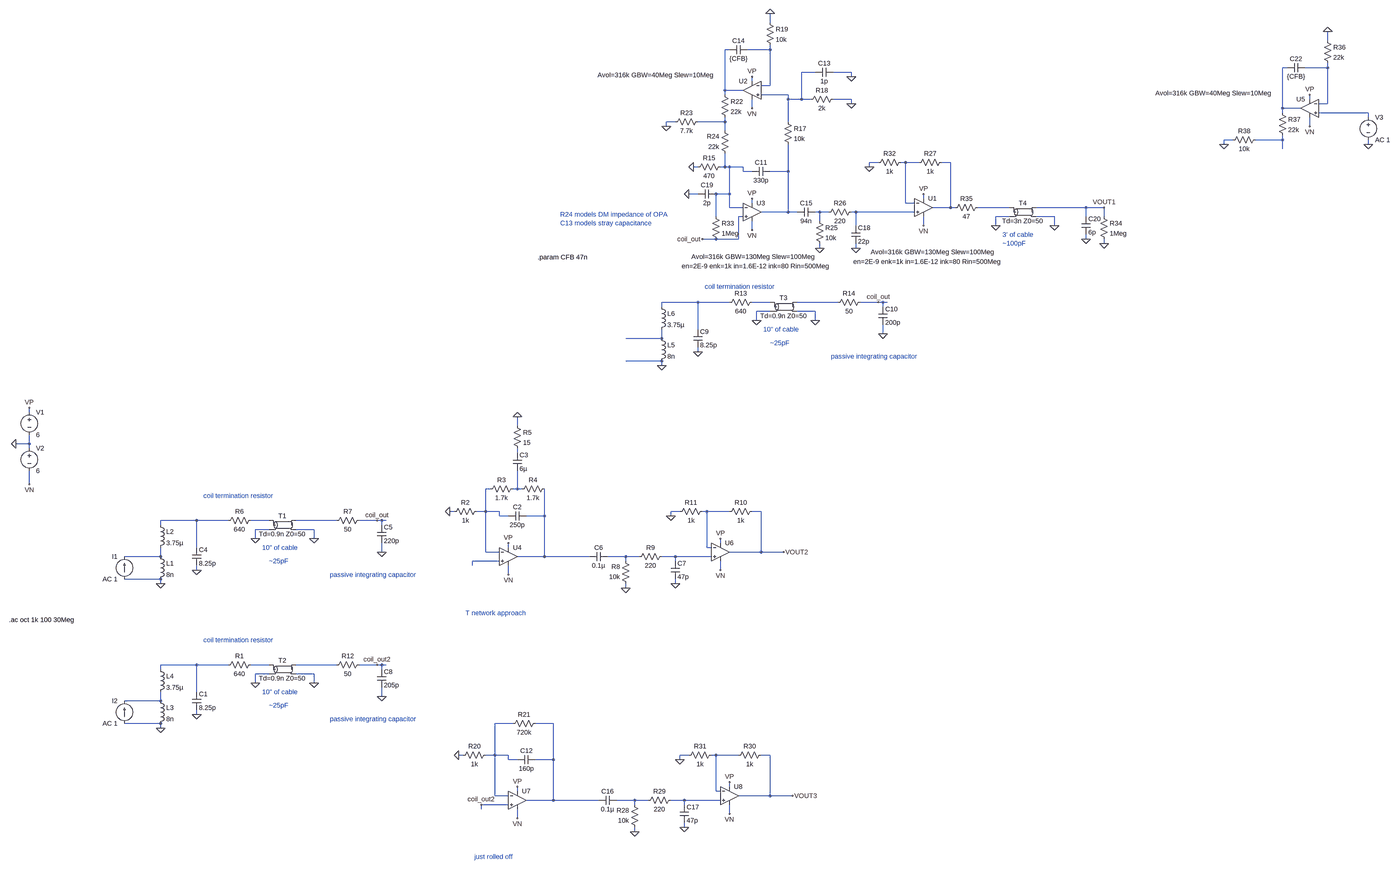
[diagram p0: schematic amp_sim.asc, whole sheet]
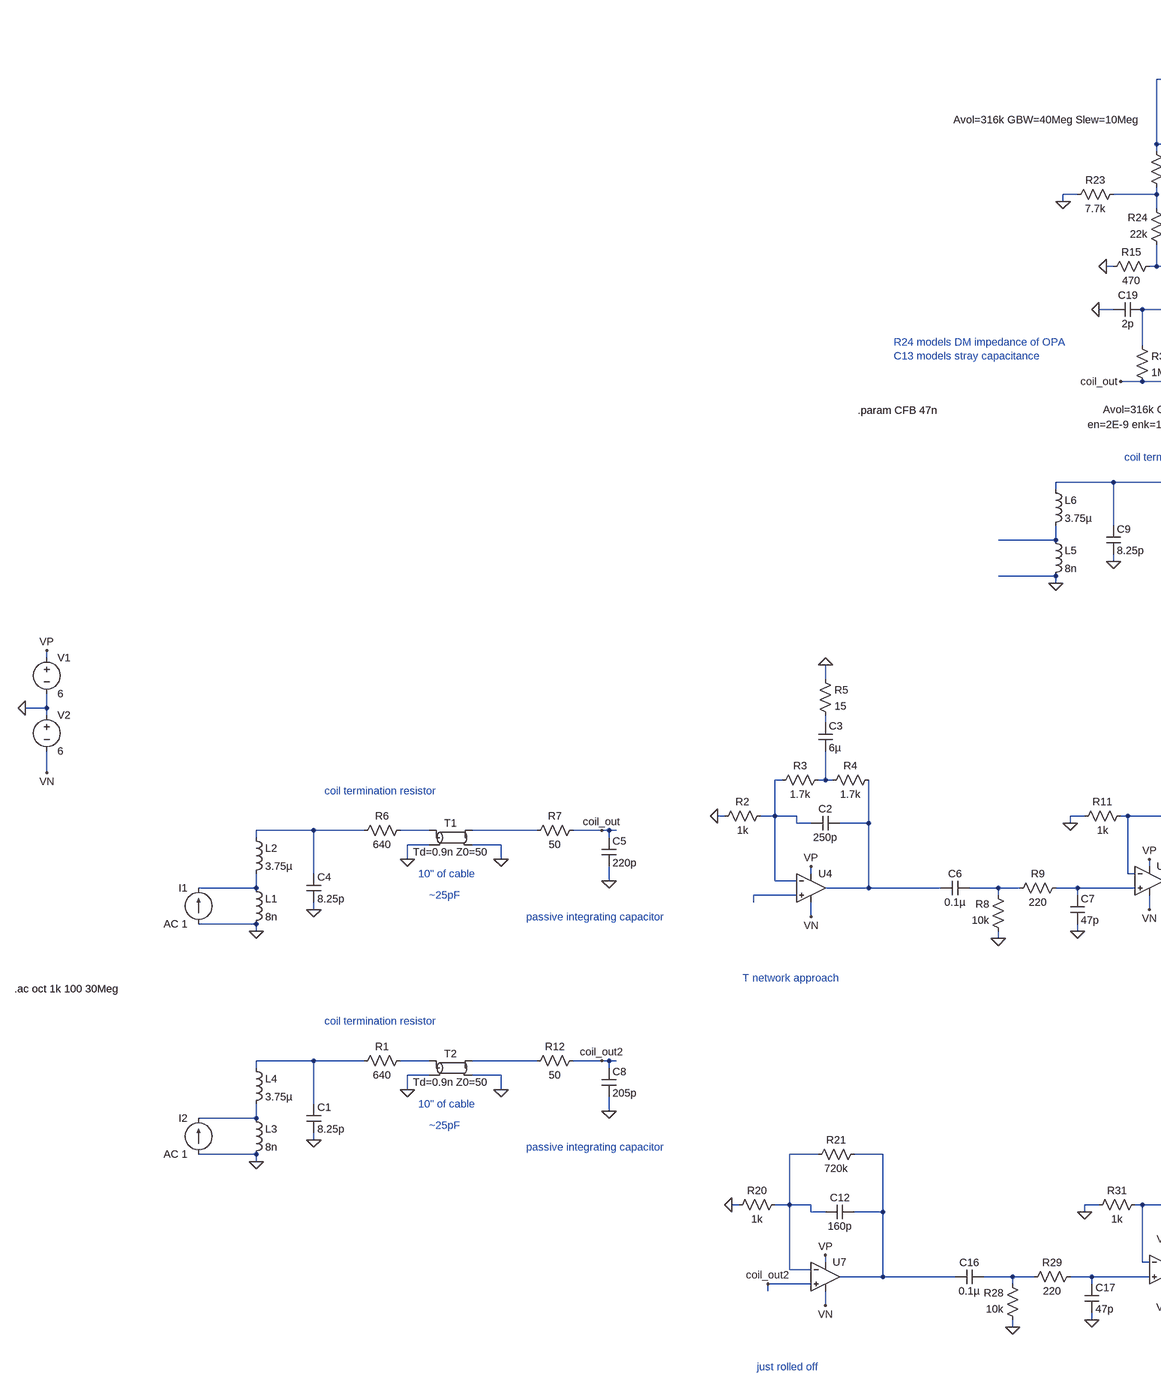
[diagram p1: schematic amp_sim.asc, part, row 1 of 1, column 1 of 2]
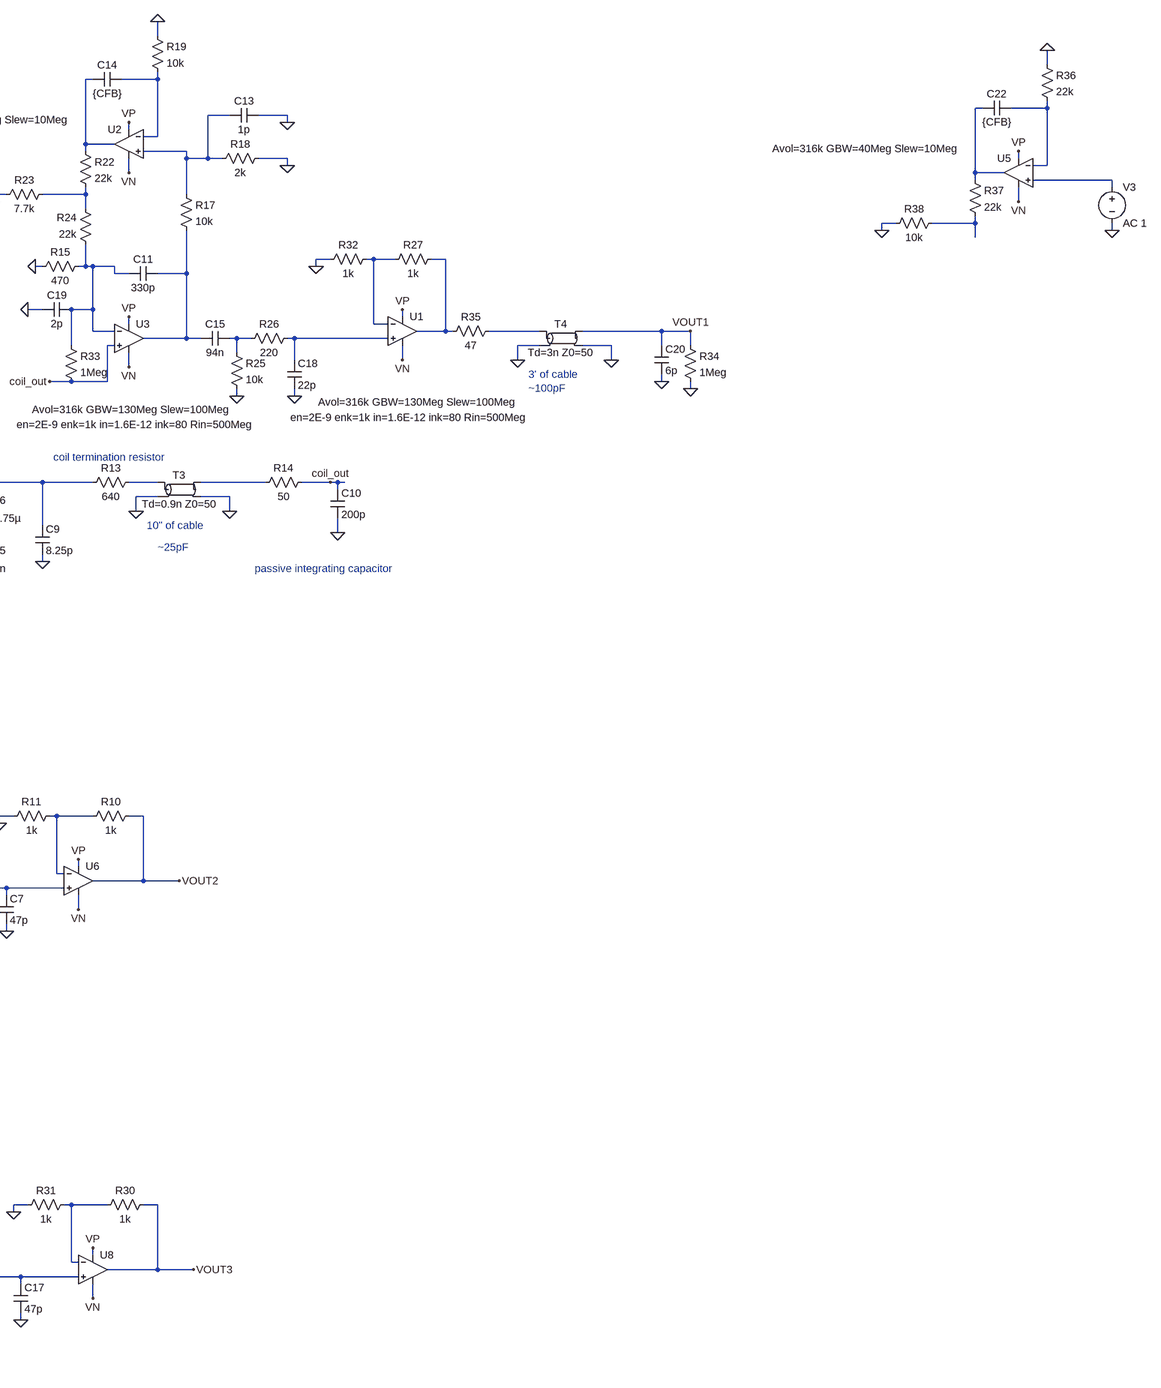
[diagram p2: schematic amp_sim.asc, part, row 1 of 1, column 2 of 2]
amp_sim.asc, the LTspice schematic file:
Version 4
SHEET 1 3540 1112
WIRE 1200 -2560 1200 -2592
WIRE 3232 -2496 3232 -2528
WIRE 1056 -2464 1040 -2464
WIRE 1200 -2464 1200 -2480
WIRE 1200 -2464 1120 -2464
WIRE 3088 -2400 3072 -2400
WIRE 3232 -2400 3232 -2416
WIRE 3232 -2400 3152 -2400
WIRE 1360 -2384 1312 -2384
WIRE 1488 -2384 1424 -2384
WIRE 1488 -2368 1488 -2384
WIRE 1136 -2352 1136 -2368
WIRE 1200 -2336 1200 -2464
WIRE 1200 -2336 1168 -2336
WIRE 1040 -2320 1040 -2464
WIRE 1104 -2320 1040 -2320
WIRE 1040 -2304 1040 -2320
WIRE 1264 -2304 1168 -2304
WIRE 1264 -2288 1264 -2304
WIRE 1312 -2288 1312 -2384
WIRE 1312 -2288 1264 -2288
WIRE 1344 -2288 1312 -2288
WIRE 1488 -2288 1424 -2288
WIRE 3168 -2288 3168 -2304
WIRE 1488 -2272 1488 -2288
WIRE 3232 -2272 3232 -2400
WIRE 3232 -2272 3200 -2272
WIRE 1136 -2256 1136 -2288
WIRE 3072 -2256 3072 -2400
WIRE 3136 -2256 3072 -2256
WIRE 3072 -2240 3072 -2256
WIRE 3376 -2240 3200 -2240
WIRE 3376 -2224 3376 -2240
WIRE 864 -2208 832 -2208
WIRE 1040 -2208 1040 -2224
WIRE 1040 -2208 944 -2208
WIRE 1264 -2208 1264 -2288
WIRE 832 -2192 832 -2208
WIRE 3168 -2192 3168 -2224
WIRE 1040 -2176 1040 -2208
WIRE 2896 -2144 2864 -2144
WIRE 3072 -2144 3072 -2160
WIRE 3072 -2144 2976 -2144
WIRE 2864 -2128 2864 -2144
WIRE 3376 -2128 3376 -2144
WIRE 3072 -2112 3072 -2144
WIRE 1584 -2064 1552 -2064
WIRE 1680 -2064 1664 -2064
WIRE 1728 -2064 1680 -2064
WIRE 1840 -2064 1808 -2064
WIRE 944 -2048 928 -2048
WIRE 1040 -2048 1040 -2096
WIRE 1040 -2048 1024 -2048
WIRE 1056 -2048 1040 -2048
WIRE 1104 -2048 1056 -2048
WIRE 1552 -2048 1552 -2064
WIRE 1104 -2032 1104 -2048
WIRE 1136 -2032 1104 -2032
WIRE 1264 -2032 1264 -2128
WIRE 1264 -2032 1200 -2032
WIRE 944 -1952 912 -1952
WIRE 1056 -1952 1056 -2048
WIRE 1056 -1952 1008 -1952
WIRE 1744 -1936 1744 -1952
WIRE 1136 -1920 1136 -1936
WIRE 1680 -1920 1680 -2064
WIRE 1712 -1920 1680 -1920
WIRE 1056 -1904 1056 -1952
WIRE 1104 -1904 1056 -1904
WIRE 1840 -1904 1840 -2064
WIRE 1840 -1904 1776 -1904
WIRE 1856 -1904 1840 -1904
WIRE 2048 -1904 1936 -1904
WIRE 2320 -1904 2144 -1904
WIRE 2384 -1904 2320 -1904
WIRE 1264 -1888 1264 -2032
WIRE 1264 -1888 1168 -1888
WIRE 1296 -1888 1264 -1888
WIRE 1376 -1888 1360 -1888
WIRE 1408 -1888 1376 -1888
WIRE 1504 -1888 1488 -1888
WIRE 1712 -1888 1504 -1888
WIRE 1008 -1872 1008 -1952
WIRE 1104 -1872 1088 -1872
WIRE 2048 -1872 2000 -1872
WIRE 2208 -1872 2144 -1872
WIRE 2320 -1872 2320 -1904
WIRE 2384 -1872 2384 -1904
WIRE 1376 -1856 1376 -1888
WIRE 1504 -1840 1504 -1888
WIRE 1744 -1840 1744 -1872
WIRE 2000 -1840 2000 -1872
WIRE 2208 -1840 2208 -1872
WIRE 1136 -1824 1136 -1856
WIRE 1008 -1792 960 -1792
WIRE 1088 -1792 1088 -1872
WIRE 1088 -1792 1008 -1792
WIRE 2320 -1792 2320 -1808
WIRE 2384 -1776 2384 -1792
WIRE 1376 -1760 1376 -1776
WIRE 1504 -1760 1504 -1776
WIRE 944 -1568 816 -1568
WIRE 1056 -1568 944 -1568
WIRE 1200 -1568 1136 -1568
WIRE 1440 -1568 1296 -1568
WIRE 1584 -1568 1520 -1568
WIRE 1600 -1568 1584 -1568
WIRE 1616 -1568 1600 -1568
WIRE 816 -1552 816 -1568
WIRE 1600 -1552 1600 -1568
WIRE 1200 -1536 1152 -1536
WIRE 1360 -1536 1296 -1536
WIRE 1152 -1504 1152 -1536
WIRE 1360 -1504 1360 -1536
WIRE 944 -1472 944 -1568
WIRE 1600 -1456 1600 -1488
WIRE 816 -1440 816 -1472
WIRE 816 -1440 688 -1440
WIRE 944 -1392 944 -1408
WIRE 816 -1360 688 -1360
WIRE 816 -1344 816 -1360
WIRE -1888 -480 -1888 -496
WIRE 304 -432 304 -464
WIRE -1888 -368 -1888 -400
WIRE -1888 -368 -1936 -368
WIRE -1888 -352 -1888 -368
WIRE 304 -336 304 -352
WIRE -1888 -224 -1888 -272
WIRE 208 -208 192 -208
WIRE 304 -208 304 -272
WIRE 304 -208 288 -208
WIRE 320 -208 304 -208
WIRE 80 -128 64 -128
WIRE 192 -128 192 -208
WIRE 192 -128 160 -128
WIRE 240 -128 192 -128
WIRE 880 -128 848 -128
WIRE 976 -128 960 -128
WIRE 1056 -128 976 -128
WIRE 1168 -128 1136 -128
WIRE 240 -112 240 -128
WIRE 272 -112 240 -112
WIRE 400 -112 400 -208
WIRE 400 -112 336 -112
WIRE 848 -112 848 -128
WIRE -1248 -96 -1376 -96
WIRE -1136 -96 -1248 -96
WIRE -992 -96 -1056 -96
WIRE -752 -96 -896 -96
WIRE -608 -96 -672 -96
WIRE -592 -96 -608 -96
WIRE -576 -96 -592 -96
WIRE -1376 -80 -1376 -96
WIRE -592 -80 -592 -96
WIRE -992 -64 -1040 -64
WIRE -832 -64 -896 -64
WIRE -1040 -32 -1040 -64
WIRE -832 -32 -832 -64
WIRE 1024 -16 1024 -32
WIRE -1248 0 -1248 -96
WIRE 272 0 272 -16
WIRE 976 0 976 -128
WIRE 992 0 976 0
WIRE -592 16 -592 -16
WIRE 192 16 192 -128
WIRE 240 16 192 16
WIRE 1168 16 1168 -128
WIRE 1168 16 1056 16
WIRE 1248 16 1168 16
WIRE -1376 32 -1376 0
WIRE -1376 32 -1504 32
WIRE 400 32 400 -112
WIRE 400 32 304 32
WIRE 560 32 400 32
WIRE 688 32 624 32
WIRE 736 32 688 32
WIRE 864 32 816 32
WIRE 992 32 864 32
WIRE 240 48 144 48
WIRE 688 48 688 32
WIRE 864 48 864 32
WIRE 144 64 144 48
WIRE -1248 80 -1248 64
WIRE 1024 80 1024 48
WIRE 272 96 272 64
WIRE -1376 112 -1504 112
WIRE -1376 128 -1376 112
WIRE 864 128 864 112
WIRE 688 144 688 128
WIRE -1248 416 -1376 416
WIRE -1136 416 -1248 416
WIRE -992 416 -1056 416
WIRE -752 416 -896 416
WIRE -608 416 -672 416
WIRE -592 416 -608 416
WIRE -576 416 -592 416
WIRE -1376 432 -1376 416
WIRE -592 432 -592 416
WIRE -992 448 -1040 448
WIRE -832 448 -896 448
WIRE -1040 480 -1040 448
WIRE -832 480 -832 448
WIRE -1248 512 -1248 416
WIRE -592 528 -592 496
WIRE -1376 544 -1376 512
WIRE -1376 544 -1504 544
WIRE -1248 592 -1248 576
WIRE -1376 624 -1504 624
WIRE 288 624 224 624
WIRE 432 624 368 624
WIRE -1376 640 -1376 624
WIRE 112 736 96 736
WIRE 224 736 224 624
WIRE 224 736 192 736
WIRE 272 736 224 736
WIRE 912 736 880 736
WIRE 1008 736 992 736
WIRE 1088 736 1008 736
WIRE 1200 736 1168 736
WIRE 272 752 272 736
WIRE 304 752 272 752
WIRE 432 752 432 624
WIRE 432 752 368 752
WIRE 880 752 880 736
WIRE 1056 848 1056 832
WIRE 304 864 304 848
WIRE 1008 864 1008 736
WIRE 1024 864 1008 864
WIRE 224 880 224 736
WIRE 272 880 224 880
WIRE 1200 880 1200 736
WIRE 1200 880 1088 880
WIRE 1280 880 1200 880
WIRE 432 896 432 752
WIRE 432 896 336 896
WIRE 592 896 432 896
WIRE 720 896 656 896
WIRE 768 896 720 896
WIRE 896 896 848 896
WIRE 1024 896 896 896
WIRE 272 912 176 912
WIRE 720 912 720 896
WIRE 896 912 896 896
WIRE 176 928 176 912
WIRE 1056 944 1056 912
WIRE 304 960 304 928
WIRE 896 992 896 976
WIRE 720 1008 720 992
FLAG -1936 -368 0
FLAG -1888 -496 VP
FLAG 272 -16 VP
FLAG -1888 -224 VN
FLAG 272 96 VN
FLAG 64 -128 0
FLAG 304 -464 0
FLAG -1248 80 0
FLAG -1376 128 0
FLAG -1040 -32 0
FLAG -832 -32 0
FLAG -592 16 0
FLAG 864 128 0
FLAG 688 144 0
FLAG 1024 -32 VP
FLAG 1024 80 VN
FLAG 848 -112 0
FLAG -608 -96 coil_out
FLAG 1248 16 VOUT2
FLAG -1248 592 0
FLAG -1376 640 0
FLAG -1040 480 0
FLAG -832 480 0
FLAG -592 528 0
FLAG -608 416 coil_out2
FLAG 304 848 VP
FLAG 304 960 VN
FLAG 96 736 0
FLAG 896 992 0
FLAG 720 1008 0
FLAG 1056 832 VP
FLAG 1056 944 VN
FLAG 880 752 0
FLAG 1280 880 VOUT3
FLAG 176 912 coil_out2
FLAG 944 -1392 0
FLAG 816 -1344 0
FLAG 1152 -1504 0
FLAG 1360 -1504 0
FLAG 1600 -1456 0
FLAG 1584 -1568 coil_out
FLAG 1136 -1936 VP
FLAG 1136 -1824 VN
FLAG 928 -2048 0
FLAG 1136 -2368 VP
FLAG 1136 -2256 VN
FLAG 1488 -2272 0
FLAG 1488 -2368 0
FLAG 1200 -2592 0
FLAG 832 -2192 0
FLAG 1744 -1952 VP
FLAG 1744 -1840 VN
FLAG 1504 -1760 0
FLAG 1376 -1760 0
FLAG 1552 -2048 0
FLAG 2384 -1904 VOUT1
FLAG 960 -1792 coil_out
FLAG 912 -1952 0
FLAG 2000 -1840 0
FLAG 2208 -1840 0
FLAG 2320 -1792 0
FLAG 2384 -1776 0
FLAG 3168 -2304 VP
FLAG 3168 -2192 VN
FLAG 3232 -2528 0
FLAG 2864 -2128 0
FLAG 3376 -2128 0
SYMBOL voltage -1888 -496 R0
WINDOW 123 0 0 Left 0
WINDOW 39 0 0 Left 0
SYMATTR InstName V1
SYMATTR Value 6
SYMBOL voltage -1888 -368 R0
WINDOW 123 0 0 Left 0
WINDOW 39 0 0 Left 0
SYMATTR InstName V2
SYMATTR Value 6
SYMBOL res 64 -112 R270
WINDOW 0 32 56 VTop 2
WINDOW 3 0 56 VBottom 2
SYMATTR InstName R2
SYMATTR Value 1k
SYMBOL cap 336 -128 R90
WINDOW 0 0 32 VBottom 2
WINDOW 3 32 32 VTop 2
SYMATTR InstName C2
SYMATTR Value 250p
SYMBOL res 304 -224 R90
WINDOW 0 0 56 VBottom 2
WINDOW 3 32 56 VTop 2
SYMATTR InstName R3
SYMATTR Value 1.7k
SYMBOL res 416 -224 R90
WINDOW 0 0 56 VBottom 2
WINDOW 3 32 56 VTop 2
SYMATTR InstName R4
SYMATTR Value 1.7k
SYMBOL cap 288 -336 R0
SYMATTR InstName C3
SYMATTR Value 6µ
SYMBOL res 288 -448 R0
SYMATTR InstName R5
SYMATTR Value 15
SYMBOL ind -1392 16 R0
SYMATTR InstName L1
SYMATTR Value 8n
SYMATTR SpiceLine Rser=0
SYMBOL ind -1392 -96 R0
SYMATTR InstName L2
SYMATTR Value 3.75µ
SYMBOL cap -1264 0 R0
SYMATTR InstName C4
SYMATTR Value 8.25p
SYMBOL current -1504 112 R180
WINDOW 0 24 80 Left 2
WINDOW 3 24 0 Left 2
WINDOW 123 0 0 Left 0
WINDOW 39 0 0 Left 0
SYMATTR InstName I1
SYMATTR Value AC 1
SYMBOL res -1040 -112 R90
WINDOW 0 0 56 VBottom 2
WINDOW 3 32 56 VTop 2
SYMATTR InstName R6
SYMATTR Value 640
SYMBOL res -656 -112 R90
WINDOW 0 0 56 VBottom 2
WINDOW 3 32 56 VTop 2
SYMATTR InstName R7
SYMATTR Value 50
SYMBOL tline -944 -80 R0
SYMATTR InstName T1
SYMATTR Value Td=0.9n Z0=50
SYMBOL cap -608 -80 R0
SYMATTR InstName C5
SYMATTR Value 220p
SYMBOL res 704 144 R180
WINDOW 0 36 76 Left 2
WINDOW 3 36 40 Left 2
SYMATTR InstName R8
SYMATTR Value 10k
SYMBOL cap 624 16 R90
WINDOW 0 0 32 VBottom 2
WINDOW 3 32 32 VTop 2
SYMATTR InstName C6
SYMATTR Value 0.1µ
SYMBOL res 832 16 R90
WINDOW 0 0 56 VBottom 2
WINDOW 3 32 56 VTop 2
SYMATTR InstName R9
SYMATTR Value 220
SYMBOL cap 848 48 R0
SYMATTR InstName C7
SYMATTR Value 47p
SYMBOL res 1152 -144 R90
WINDOW 0 0 56 VBottom 2
WINDOW 3 32 56 VTop 2
SYMATTR InstName R10
SYMATTR Value 1k
SYMBOL res 976 -144 R90
WINDOW 0 0 56 VBottom 2
WINDOW 3 32 56 VTop 2
SYMATTR InstName R11
SYMATTR Value 1k
SYMBOL ind -1392 528 R0
SYMATTR InstName L3
SYMATTR Value 8n
SYMATTR SpiceLine Rser=0
SYMBOL ind -1392 416 R0
SYMATTR InstName L4
SYMATTR Value 3.75µ
SYMBOL cap -1264 512 R0
SYMATTR InstName C1
SYMATTR Value 8.25p
SYMBOL current -1504 624 R180
WINDOW 0 24 80 Left 2
WINDOW 3 24 0 Left 2
WINDOW 123 0 0 Left 0
WINDOW 39 0 0 Left 0
SYMATTR InstName I2
SYMATTR Value AC 1
SYMBOL res -1040 400 R90
WINDOW 0 0 56 VBottom 2
WINDOW 3 32 56 VTop 2
SYMATTR InstName R1
SYMATTR Value 640
SYMBOL res -656 400 R90
WINDOW 0 0 56 VBottom 2
WINDOW 3 32 56 VTop 2
SYMATTR InstName R12
SYMATTR Value 50
SYMBOL tline -944 432 R0
SYMATTR InstName T2
SYMATTR Value Td=0.9n Z0=50
SYMBOL cap -608 432 R0
SYMATTR InstName C8
SYMATTR Value 205p
SYMBOL OpAmps\\UniversalOpamp2 272 32 R0
SYMATTR InstName U4
SYMATTR Value2 Avol=316k GBW=50Meg Slew=100Meg
SYMATTR SpiceLine2 en=6E-9 enk=25 in=0.4E-12 ink=2k Rin=500Meg
SYMBOL OpAmps\\UniversalOpamp2 1024 16 R0
SYMATTR InstName U6
SYMATTR Value2 Avol=316k GBW=50Meg Slew=100Meg
SYMATTR SpiceLine2 en=6E-9 enk=25 in=0.4E-12 ink=2k Rin=500Meg
SYMBOL res 96 752 R270
WINDOW 0 32 56 VTop 2
WINDOW 3 0 56 VBottom 2
SYMATTR InstName R20
SYMATTR Value 1k
SYMBOL cap 368 736 R90
WINDOW 0 0 32 VBottom 2
WINDOW 3 32 32 VTop 2
SYMATTR InstName C12
SYMATTR Value 160p
SYMBOL res 736 1008 R180
WINDOW 0 36 76 Left 2
WINDOW 3 36 40 Left 2
SYMATTR InstName R28
SYMATTR Value 10k
SYMBOL cap 656 880 R90
WINDOW 0 0 32 VBottom 2
WINDOW 3 32 32 VTop 2
SYMATTR InstName C16
SYMATTR Value 0.1µ
SYMBOL res 864 880 R90
WINDOW 0 0 56 VBottom 2
WINDOW 3 32 56 VTop 2
SYMATTR InstName R29
SYMATTR Value 220
SYMBOL cap 880 912 R0
SYMATTR InstName C17
SYMATTR Value 47p
SYMBOL res 1184 720 R90
WINDOW 0 0 56 VBottom 2
WINDOW 3 32 56 VTop 2
SYMATTR InstName R30
SYMATTR Value 1k
SYMBOL res 1008 720 R90
WINDOW 0 0 56 VBottom 2
WINDOW 3 32 56 VTop 2
SYMATTR InstName R31
SYMATTR Value 1k
SYMBOL OpAmps\\UniversalOpamp2 304 896 R0
SYMATTR InstName U7
SYMATTR Value2 Avol=316k GBW=50Meg Slew=100Meg
SYMATTR SpiceLine2 en=6E-9 enk=25 in=0.4E-12 ink=2k Rin=500Meg
SYMBOL OpAmps\\UniversalOpamp2 1056 880 R0
SYMATTR InstName U8
SYMATTR Value2 Avol=316k GBW=50Meg Slew=100Meg
SYMATTR SpiceLine2 en=6E-9 enk=25 in=0.4E-12 ink=2k Rin=500Meg
SYMBOL res 384 608 R90
WINDOW 0 0 56 VBottom 2
WINDOW 3 32 56 VTop 2
SYMATTR InstName R21
SYMATTR Value 720k
SYMBOL ind 800 -1456 R0
SYMATTR InstName L5
SYMATTR Value 8n
SYMATTR SpiceLine Rser=0
SYMBOL ind 800 -1568 R0
SYMATTR InstName L6
SYMATTR Value 3.75µ
SYMBOL cap 928 -1472 R0
SYMATTR InstName C9
SYMATTR Value 8.25p
SYMBOL res 1152 -1584 R90
WINDOW 0 0 56 VBottom 2
WINDOW 3 32 56 VTop 2
SYMATTR InstName R13
SYMATTR Value 640
SYMBOL res 1536 -1584 R90
WINDOW 0 0 56 VBottom 2
WINDOW 3 32 56 VTop 2
SYMATTR InstName R14
SYMATTR Value 50
SYMBOL tline 1248 -1552 R0
SYMATTR InstName T3
SYMATTR Value Td=0.9n Z0=50
SYMBOL cap 1584 -1552 R0
SYMATTR InstName C10
SYMATTR Value 200p
SYMBOL res 928 -2032 R270
WINDOW 0 32 56 VTop 2
WINDOW 3 0 56 VBottom 2
SYMATTR InstName R15
SYMATTR Value 470
SYMBOL cap 1200 -2048 R90
WINDOW 0 0 32 VBottom 2
WINDOW 3 32 32 VTop 2
SYMATTR InstName C11
SYMATTR Value 330p
SYMBOL res 1248 -2224 R0
SYMATTR InstName R17
SYMATTR Value 10k
SYMBOL res 1440 -2304 R90
WINDOW 0 0 56 VBottom 2
WINDOW 3 32 56 VTop 2
SYMATTR InstName R18
SYMATTR Value 2k
SYMBOL cap 1424 -2400 R90
WINDOW 0 0 32 VBottom 2
WINDOW 3 32 32 VTop 2
SYMATTR InstName C13
SYMATTR Value 1p
SYMBOL res 1184 -2576 R0
SYMATTR InstName R19
SYMATTR Value 10k
SYMBOL cap 1120 -2480 R90
WINDOW 0 0 32 VBottom 2
WINDOW 3 32 32 VTop 2
SYMATTR InstName C14
SYMATTR Value {CFB}
SYMBOL res 1024 -2320 R0
SYMATTR InstName R22
SYMATTR Value 22k
SYMBOL res 960 -2224 R90
WINDOW 0 0 56 VBottom 2
WINDOW 3 32 56 VTop 2
SYMATTR InstName R23
SYMATTR Value 7.7k
SYMBOL res 1056 -2080 R180
WINDOW 0 36 76 Left 2
WINDOW 3 36 40 Left 2
SYMATTR InstName R24
SYMATTR Value 22k
SYMBOL cap 1360 -1904 R90
WINDOW 0 0 32 VBottom 2
WINDOW 3 32 32 VTop 2
SYMATTR InstName C15
SYMATTR Value 94n
SYMBOL res 1360 -1872 R0
SYMATTR InstName R25
SYMATTR Value 10k
SYMBOL res 1504 -1904 R90
WINDOW 0 0 56 VBottom 2
WINDOW 3 32 56 VTop 2
SYMATTR InstName R26
SYMATTR Value 220
SYMBOL cap 1488 -1840 R0
SYMATTR InstName C18
SYMATTR Value 22p
SYMBOL res 1824 -2080 R90
WINDOW 0 0 56 VBottom 2
WINDOW 3 32 56 VTop 2
SYMATTR InstName R27
SYMATTR Value 1k
SYMBOL res 1680 -2080 R90
WINDOW 0 0 56 VBottom 2
WINDOW 3 32 56 VTop 2
SYMATTR InstName R32
SYMATTR Value 1k
SYMBOL OpAmps\\UniversalOpamp2 1136 -2320 M0
WINDOW 123 135 -54 Left 2
SYMATTR Value2 Avol=316k GBW=40Meg Slew=10Meg
SYMATTR InstName U2
SYMATTR SpiceLine2 en=1E-9 enk=25 in=0.04E-12 ink=2k Rin=500Meg
SYMBOL cap 1008 -1968 R90
WINDOW 0 0 32 VBottom 2
WINDOW 3 32 32 VTop 2
SYMATTR InstName C19
SYMATTR Value 2p
SYMBOL res 992 -1888 R0
SYMATTR InstName R33
SYMATTR Value 1Meg
SYMBOL OpAmps\\UniversalOpamp2 1136 -1888 R0
WINDOW 123 -215 158 Left 2
WINDOW 40 -249 192 Left 2
SYMATTR Value2 Avol=316k GBW=130Meg Slew=100Meg
SYMATTR SpiceLine2 en=2E-9 enk=1k in=1.6E-12 ink=80 Rin=500Meg
SYMATTR InstName U3
SYMATTR SpiceLine ilimit=80m rail=0 Vos=0 phimargin=45
SYMBOL tline 2096 -1888 R0
SYMATTR InstName T4
SYMATTR Value Td=3n Z0=50
SYMBOL res 2368 -1888 R0
SYMATTR InstName R34
SYMATTR Value 1Meg
SYMBOL cap 2304 -1872 R0
SYMATTR InstName C20
SYMATTR Value 6p
SYMBOL res 1952 -1920 R90
WINDOW 0 0 56 VBottom 2
WINDOW 3 32 56 VTop 2
SYMATTR InstName R35
SYMATTR Value 47
SYMBOL OpAmps\\UniversalOpamp2 1744 -1904 R0
WINDOW 123 -187 158 Left 2
WINDOW 40 -249 192 Left 2
SYMATTR Value2 Avol=316k GBW=130Meg Slew=100Meg
SYMATTR SpiceLine2 en=2E-9 enk=1k in=1.6E-12 ink=80 Rin=500Meg
SYMATTR InstName U1
SYMATTR SpiceLine ilimit=80m rail=0 Vos=0 phimargin=45
SYMBOL res 3216 -2512 R0
SYMATTR InstName R36
SYMATTR Value 22k
SYMBOL cap 3152 -2416 R90
WINDOW 0 0 32 VBottom 2
WINDOW 3 32 32 VTop 2
SYMATTR InstName C22
SYMATTR Value {CFB}
SYMBOL res 3056 -2256 R0
SYMATTR InstName R37
SYMATTR Value 22k
SYMBOL res 2992 -2160 R90
WINDOW 0 0 56 VBottom 2
WINDOW 3 32 56 VTop 2
SYMATTR InstName R38
SYMATTR Value 10k
SYMBOL OpAmps\\UniversalOpamp2 3168 -2256 M0
WINDOW 123 135 -54 Left 2
SYMATTR Value2 Avol=316k GBW=40Meg Slew=10Meg
SYMATTR InstName U5
SYMATTR SpiceLine2 en=1E-9 enk=25 in=0.04E-12 ink=2k Rin=500Meg
SYMBOL voltage 3376 -2240 R0
WINDOW 123 0 0 Left 0
WINDOW 39 0 0 Left 0
SYMATTR InstName V3
SYMATTR Value AC 1
TEXT -1016 0 Left 2 ;10" of cable
TEXT -1224 -184 Left 2 ;coil termination resistor
TEXT -776 96 Left 2 ;passive integrating capacitor
TEXT 120 232 Left 2 ;T network approach
TEXT -992 48 Left 2 ;~25pF
TEXT -1960 256 Left 2 !.ac oct 1k 100 30Meg
TEXT -1016 512 Left 2 ;10" of cable
TEXT -1224 328 Left 2 ;coil termination resistor
TEXT -776 608 Left 2 ;passive integrating capacitor
TEXT -992 560 Left 2 ;~25pF
TEXT 152 1096 Left 2 ;just rolled off
TEXT 1176 -1472 Left 2 ;10" of cable
TEXT 968 -1624 Left 2 ;coil termination resistor
TEXT 1416 -1376 Left 2 ;passive integrating capacitor
TEXT 1200 -1424 Left 2 ;~25pF
TEXT 456 -1880 Left 2 ;R24 models DM impedance of OPA\nC13 models stray capacitance
TEXT 2024 -1808 Left 2 ;3' of cable\n~100pF
TEXT 376 -1728 Left 2 !.param CFB 47n

The netlist it stands for:
* amp_sim.asc
V1 VP 0 6
V2 0 VN 6
R2 0 N021 1k
C2 N024 N021 250p
R3 N022 N021 1.7k
R4 N024 N022 1.7k
C3 N020 N022 6µ
R5 0 N020 15
L1 N028 0 8n Rser=0
L2 N025 N028 3.75µ
C4 N025 0 8.25p
I1 0 N028 AC 1
R6 N026 N025 640
R7 coil_out N027 50
T1 N026 0 N027 0 Td=0.9n Z0=50
C5 coil_out 0 220p
R8 0 N029 10k
C6 N029 N024 0.1µ
R9 N030 N029 220
C7 N030 0 47p
R10 VOUT2 N023 1k
R11 N023 0 1k
L3 N035 0 8n Rser=0
L4 N032 N035 3.75µ
C1 N032 0 8.25p
I2 0 N035 AC 1
R1 N033 N032 640
R12 coil_out2 N034 50
T2 N033 0 N034 0 Td=0.9n Z0=50
C8 coil_out2 0 205p
XU4 N031 N021 VP VN N024 level.2 Avol=316k GBW=50Meg Slew=100Meg ilimit=25m rail=0 Vos=0 phimargin=45 en=6E-9 enk=25 in=0.4E-12 ink=2k Rin=500Meg  ; pins IN+ IN- V+ V- OUT
XU6 N030 N023 VP VN VOUT2 level.2 Avol=316k GBW=50Meg Slew=100Meg ilimit=25m rail=0 Vos=0 phimargin=45 en=6E-9 enk=25 in=0.4E-12 ink=2k Rin=500Meg  ; pins IN+ IN- V+ V- OUT
R20 0 N036 1k
C12 N037 N036 160p
R28 0 N039 10k
C16 N039 N037 0.1µ
R29 N040 N039 220
C17 N040 0 47p
R30 VOUT3 N038 1k
R31 N038 0 1k
XU7 coil_out2 N036 VP VN N037 level.2 Avol=316k GBW=50Meg Slew=100Meg ilimit=25m rail=0 Vos=0 phimargin=45 en=6E-9 enk=25 in=0.4E-12 ink=2k Rin=500Meg  ; pins IN+ IN- V+ V- OUT
XU8 N040 N038 VP VN VOUT3 level.2 Avol=316k GBW=50Meg Slew=100Meg ilimit=25m rail=0 Vos=0 phimargin=45 en=6E-9 enk=25 in=0.4E-12 ink=2k Rin=500Meg  ; pins IN+ IN- V+ V- OUT
R21 N037 N036 720k
L5 N019 0 8n Rser=0
L6 N016 N019 3.75µ
C9 N016 0 8.25p
R13 N017 N016 640
R14 coil_out N018 50
T3 N017 0 N018 0 Td=0.9n Z0=50
C10 coil_out 0 200p
R15 0 N011 470
C11 N012 N011 330p
R17 N005 N012 10k
R18 0 N005 2k
C13 0 N005 1p
R19 0 N002 10k
C14 N002 N001 {CFB}
R22 N001 N007 22k
R23 N007 0 7.7k
R24 N011 N007 22k
C15 N014 N012 94n
R25 N014 0 10k
R26 N015 N014 220
C18 N015 0 22p
R27 N010 N009 1k
R32 N009 0 1k
XU2 N005 N002 VP VN N001 level.2 Avol=316k GBW=40Meg Slew=10Meg ilimit=25m rail=0 Vos=0 phimargin=45 en=1E-9 enk=25 in=0.04E-12 ink=2k Rin=500Meg  ; pins IN+ IN- V+ V- OUT
C19 N011 0 2p
R33 N011 coil_out 1Meg
XU3 coil_out N011 VP VN N012 level.2 Avol=316k GBW=130Meg Slew=100Meg ilimit=80m rail=0 Vos=0 phimargin=45 en=2E-9 enk=1k in=1.6E-12 ink=80 Rin=500Meg  ; pins IN+ IN- V+ V- OUT
T4 N013 0 VOUT1 0 Td=3n Z0=50
R34 VOUT1 0 1Meg
C20 VOUT1 0 6p
R35 N013 N010 47
XU1 N015 N009 VP VN N010 level.2 Avol=316k GBW=130Meg Slew=100Meg ilimit=80m rail=0 Vos=0 phimargin=45 en=2E-9 enk=1k in=1.6E-12 ink=80 Rin=500Meg  ; pins IN+ IN- V+ V- OUT
R36 0 N004 22k
C22 N004 N003 {CFB}
R37 N003 N008 22k
R38 N008 0 10k
XU5 N006 N004 VP VN N003 level.2 Avol=316k GBW=40Meg Slew=10Meg ilimit=25m rail=0 Vos=0 phimargin=45 en=1E-9 enk=25 in=0.04E-12 ink=2k Rin=500Meg  ; pins IN+ IN- V+ V- OUT
V3 N006 0 AC 1
* 10" of cable
* coil termination resistor
* passive integrating capacitor
* T network approach
* ~25pF
.ac oct 1k 100 30Meg
* 10" of cable
* coil termination resistor
* passive integrating capacitor
* ~25pF
* just rolled off
* 10" of cable
* coil termination resistor
* passive integrating capacitor
* ~25pF
* R24 models DM impedance of OPA
* C13 models stray capacitance
* 3' of cable
* ~100pF
.param CFB 47n
.lib UniversalOpamps2.sub
.backanno
.end